# Altium schematic sheet RefPoint01-00.SchDoc
size A3
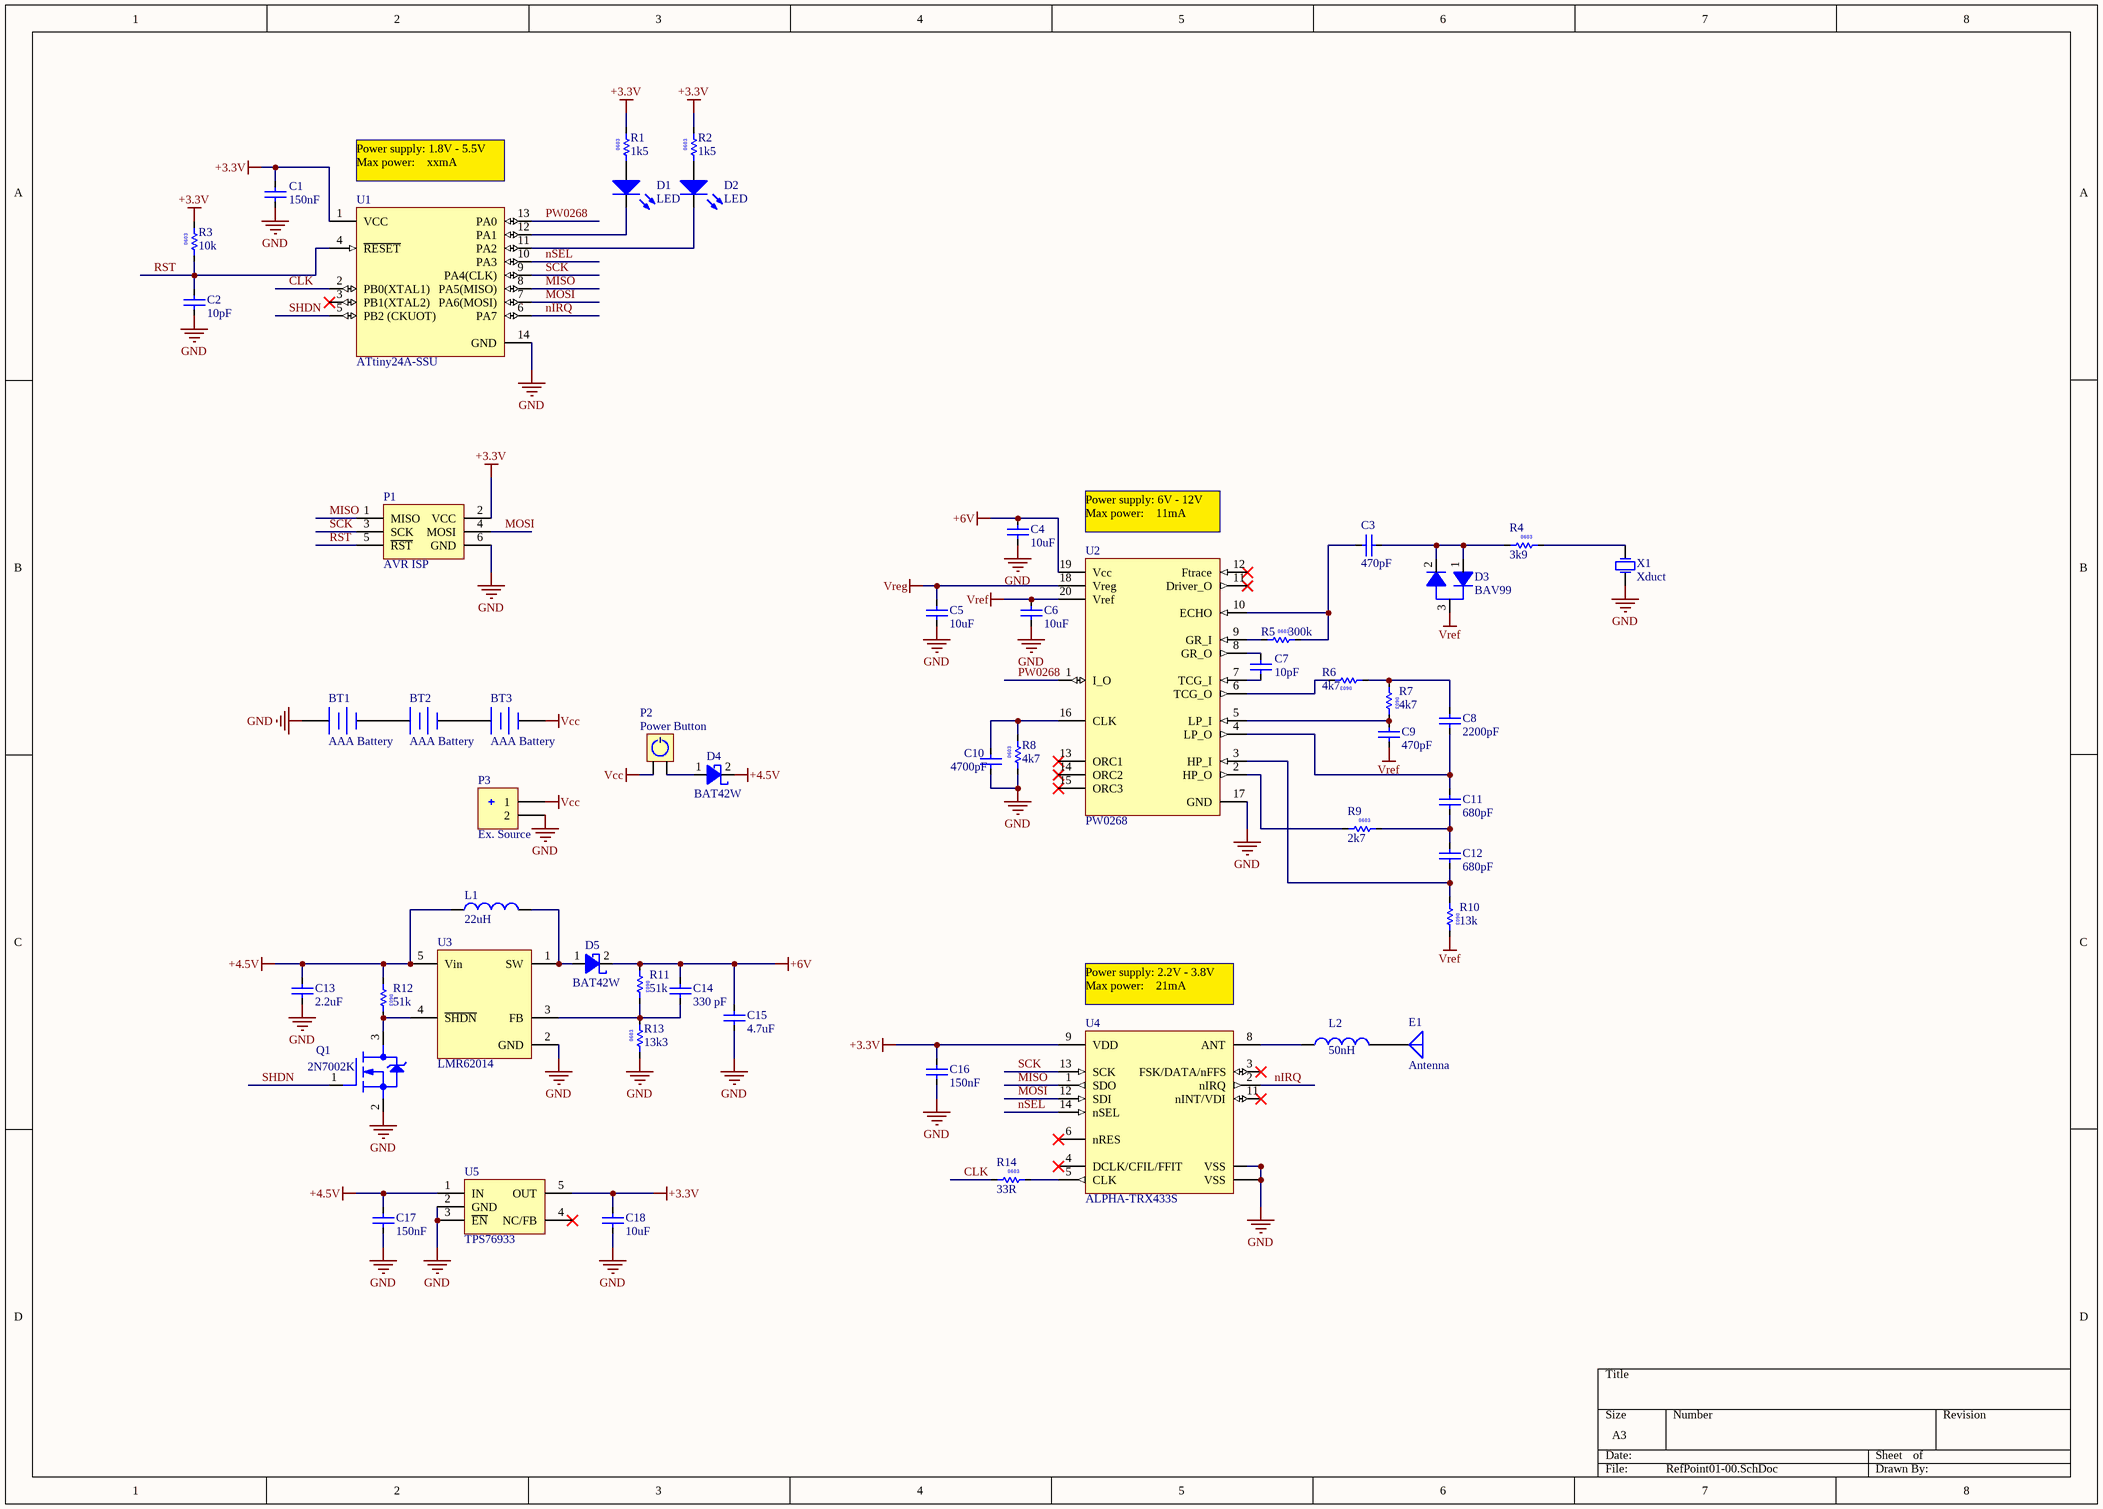
[diagram p0: RefPoint01-00.SchDoc]

## Parts
BT1  AAA Battery  [Keystone 55 AAA CLIP]
BT2  AAA Battery  [Keystone 55 AAA CLIP]
BT3  AAA Battery  [Keystone 55 AAA CLIP]
C1  150nF  [CAPC1608N]
C2  10pF  [CAPC1608N]
C3  470pF  [CAPC1608N]
C4  10uF  [CAPC3216N]
C5  10uF  [CAPC3216N]
C6  10uF  [CAPC3216N]
C7  10pF  [CAPC1608N]
C8  2200pF  [CAPC1608N]
C9  470pF  [CAPC1608N]
C10  4700pF  [CAPC1608N]
C11  680pF  [CAPC1608N]
C12  680pF  [CAPC1608N]
C13  2.2uF  [CAPC2012N]
C14  330 pF  [CAPC1608N]
C15  4.7uF  [CAPC3225N]
C16  150nF  [CAPC1608N]
C17  150nF  [CAPC1608N]
C18  10uF  [CAPC3216N]
D1  LED  [LED 3mm DIP]
D2  LED  [LED 3mm DIP]
D3  BAV99  [SOT95P240-3L]
D4  BAT42W  [SOD123]
D5  BAT42W  [SOD123]
E1  Antenna
L1  22uH  [INDM7070x32N]
L2  value 50nH  [INDC2012L]  (hidden comment: Inductor)
P1  AVR ISP  [HDR2X3]
P2  Power Button  [HDR1X2]
P3  Ex. Source  [HDR1X2]
Q1  2N7002K  [SOT23-3L]
R1  1k5  [RESC1608N]
R2  1k5  [RESC1608N]
R3  10k  [RESC1608N]
R4  3k9  [RESC1608N]
R5  300k  [RESC1608N]
R6  4k7  [RESC1608N]
R7  4k7  [RESC1608N]
R8  4k7  [RESC1608N]
R9  2k7  [RESC1608N]
R10  13k  [RESC1608N]
R11  51k  [RESC1608X50N]
R12  51k  [RESC1608X50N]
R13  13k3  [RESC1608X50N]
R14  33R  [RESC1608N]
U1  ATtiny24A-SSU  [SOIC14T_L]
U2  PW0268  [QSSOP20_0.635/4.0X8.7]
U3  LMR62014  [SOT23-5AM]
U4  ALPHA-TRX433S  [ALPHA-TRX]
U5  TPS76933  [SOT23-5AM]
X1  Xduct  [Xducts1]

## Nets
+3.3V: C1.2 C16.2 C18.2 P1.2(VCC) R1.2 R2.2 R3.2 U1.1(VCC) U4.9(VDD) U5.5(OUT)
+4.5V: C13.2 C17.2 D4.2(CATHODE) L1.2 R12.1 U3.5(Vin) U5.1(IN)
+6V: C4.2 C14.2 C15.2 D5.2(CATHODE) R11.1 U2.19(Vcc)
GND: BT1.1(+) C1.1 C2.1 C4.1 C5.1 C6.1 C10.1 C13.1 C15.1 C16.1 C17.1 C18.1 P1.6(GND) P3.2 Q1.2(S) R8.1 R13.1 U1.14(GND) U2.17(GND) U3.2(GND) U4.7(VSS) U4.10(VSS) U5.2(GND) U5.3(~{EN}) X1.2
Vcc: BT3.2(-) P2.1 P3.1
Vref: C6.2 C9.1 D3.3(K) R10.2 U2.20(Vref)
Vreg: C5.2 U2.18(Vreg)
CLK: R14.1 U1.2(PB0(XTAL1))
MISO: P1.1(MISO) U1.8(PA5(MISO)) U4.1(SDO)
MOSI: P1.4(MOSI) U1.7(PA6(MOSI)) U4.12(SDI)
nIRQ: U1.6(PA7) U4.2(nIRQ)
nSEL: U1.10(PA3) U4.14(nSEL)
PW0268: U1.13(PA0) U2.1(I_O)
RST: C2.2 P1.5(~{RST}) R3.1 U1.4(~{RESET})
SCK: P1.3(SCK) U1.9(PA4(CLK)) U4.13(SCK)
SHDN: Q1.1(G) U1.5(PB2_(CKUOT))
NetBT1_2: BT1.2(-) BT2.1(+)
NetBT2_2: BT2.2(-) BT3.1(+)
NetC3_1: C3.1 R5.2 U2.10(ECHO)
NetC3_2: C3.2 D3.1(A1) D3.2(A) R4.1
NetC7_1: C7.1 U2.8(GR_O)
NetC7_2: C7.2 U2.7(TCG_I)
NetC8_1: C8.1 C11.1 U2.4(LP_O)
NetC8_2: C8.2 R6.1 R7.1
NetC9_2: C9.2 R7.2 U2.5(LP_I)
NetC10_2: C10.2 R8.2 U2.16(CLK)
NetC11_2: C11.2 C12.1 R9.2
NetC12_2: C12.2 R10.1 U2.3(HP_I)
NetC14_1: C14.1 R11.2 R13.2 U3.3(FB)
NetD1_1: D1.1(A) R1.1
NetD1_2: D1.2(K) U1.12(PA1)
NetD2_1: D2.1(A) R2.1
NetD2_2: D2.2(K) U1.11(PA2)
NetD4_1: D4.1(ANODE) P2.2
NetD5_1: D5.1(ANODE) L1.1 U3.1(SW)
NetE1_1: E1.1(A) L2.2
NetL2_1: L2.1 U4.8(ANT)
NetQ1_3: Q1.3(D) R12.2 U3.4(~{SHDN})
NetR4_2: R4.2 X1.1
NetR5_1: R5.1 U2.9(GR_I)
NetR6_2: R6.2 U2.6(TCG_O)
NetR9_1: R9.1 U2.2(HP_O)
NetR14_2: R14.2 U4.5(CLK)

Not connected (* = marked no-connect by the designer): U1 3(PB1(XTAL2))*; U2 11(Driver_O)* 12(Ftrace)* 13(ORC1)* 14(ORC2)* 15(ORC3)*; U4 3(FSK/DATA/nFFS)* 4(DCLK/CFIL/FFIT)* 6(nRES)* 11(nINT/VDI)*; U5 4(NC/FB)*

## Notes on the sheet
- (near U1) Power supply: 1.8V - 5.5V
  Max power:    xxmA
- (near U2) Power supply: 6V - 12V
  Max power:    11mA
- (near U4) Power supply: 2.2V - 3.8V
  Max power:    21mA
- (in symbol R0000008) 0603
- (in symbol R0000455) 0603
- (in symbol R0000522) 0603
- (in symbol R2406036) 0603
- (in symbol R2406076) 0603
- (in symbol R2406082) 0603
- (in symbol R2406086) 0603
- (in symbol R2406088) 0603
- (in symbol R2406099) 0603
- (in symbol R2406131) 0603

## Library data of the parts
BT1-BT3 = Battery_AAA: Battery AAA; Manufacturer: KEYSTONE; Manufacturer Part Number: 55; Supplier Part Number 1: 1702644; Data Sheet: http://www.farnell.com/datasheets/1703982.pdf; Supplier 1: Farnell
C1 C16 C17 = C0000001: MLCC, 150nF 16V -20+80% Y5V; Manufacturer: YAGEO; Manufacturer Part Number: CTC0603ZRY5V7BB154; Voltage: 16; Project: PSP500; Part Number: C0000001; Part Type: MLCC; Tolerance: -20+80%; Material: Y5V; Package: 0603 (1608 metric); SMD: Yes; Supplier 1: Farnell; Supplier Part Number 1: 3352006; Supplier 2: Mouser; Supplier Part Number 2: 80-C0603C154K4R; ComponentLink1Description: MFG link; ComponentLink1URL: http://www.yageo.com/documents/recent/UPY-GPHC_Y5V_6.3V-to-50V_5.pdf; ComponentLink2URL: \\193.219.36.50\nescafe\Altium Database\KTU340DB\PDF\Capacitor\Multilayer Ceramic\UPY-GPHC_Y5V_6.3V-to-50V_5.pdf; Data: 2011.01.31
C2 C7 = C0000042: MLCC, 0603, NP0, 50V, 10PF; Manufacturer: MULTICOMP; Manufacturer Part Number: MCCA000192; Voltage: 100; Material: C0G / NP0; Project: Zhilinskas_I/II/III; Part Number: C0000042; Part Type: MLCC; Package: 0603 (1608 metric); SMD: Yes; Supplier 1: Farnell; Supplier Part Number 1: 1759053; Price: 0,02; MOQ: 100; Supplier 2: Mouser; Supplier Part Number 2: 77-VJ0603A100JXACBC; ComponentLink1Description: MFG link; ComponentLink1URL: http://www.farnell.com/datasheets/654515.pdf; Data: 2011.06.12
C3 C9 = C0000062: MLCC, 470pF 50V C0G 5% 0603; Manufacturer: MULTICOMP; Manufacturer Part Number: MCCA000217; Voltage: 50; Material: C0G / NP0; Part Number: C0000062; Part Type: MLCC; Tolerance: ±5%; Package: 0603 (1608 metric); SMD: Yes; Supplier 1: Farnell; Supplier Part Number 1: 1759080; ComponentLink1Description: MFG link; ComponentLink1URL: http://www.farnell.com/datasheets/654515.pdf; Qty: 100; Data: 2011.04.11
C4-C6 C18 = C0000011: MLCC, 10uF 25V -20%, +80% Y5V 1206; Manufacturer: MULTICOMP; Manufacturer Part Number: MC1206F106Z250CT; Voltage: 25; Project: PSP500; Part Number: C0000011; Part Type: MLCC; Tolerance: -20%, +80%; Material: Y5V; Package: 1206 (3216 metric); SMD: Yes; Supplier 1: Farnell; Supplier Part Number 1: 1759453; Price: 0,299; ComponentLink1Description: MFG link; ComponentLink1URL: http://www.farnell.com/datasheets/461910.pdf; Data: 2011.02.01
C8 = C0000126: MLCC, 2200pF 50V X7R 5% 0603; Manufacturer: MULTICOMP; Manufacturer Part Number: MC0603B222J500CT; Voltage: 50; Part Number: C0000126; Part Type: MLCC; Tolerance: ±5%; Material: X7R; Package: 0603 (1608 metric); SMD: Yes; Supplier 1: Farnell; Supplier Part Number 1: 2320806; ComponentLink1Description: MFG link; ComponentLink1URL: http://www.farnell.com/datasheets/1870456.pdf; Data: 2011.04.11
C10 = C0000127: MLCC, 4700pF 50V X7R 5% 0603; Manufacturer: MULTICOMP; Manufacturer Part Number: MC0603B472J500CT; Voltage: 50; Part Number: C0000127; Part Type: MLCC; Tolerance: ±5%; Material: X7R; Package: 0603 (1608 metric); SMD: Yes; Supplier 1: Farnell; Supplier Part Number 1: 2320809; ComponentLink1Description: MFG link; ComponentLink1URL: http://www.farnell.com/datasheets/1870456.pdf; Data: 2011.04.11
C11 C12 = C0000125: MLCC, 680pF 50V C0G / NP0 5% 0603; Manufacturer: MULTICOMP; Manufacturer Part Number: MC0603N681J500CT; Voltage: 50; Part Number: C0000125; Part Type: MLCC; Tolerance: ±5%; Material: C0G / NP0; Package: 0603 (1608 metric); SMD: Yes; Supplier 1: Farnell; Supplier Part Number 1: 1759084; ComponentLink1Description: MFG link; ComponentLink1URL: http://www.farnell.com/datasheets/1901289.pdf; Data: 2011.04.11
C13 = C0000129: MLCC, 2.2uF 16V X7R 0805; Manufacturer: MURATA; Manufacturer Part Number: GRM21BR71C225KA12L; Tolerance: ±10%; Part Number: C0000129; Part Type: MLCC; Voltage: 16V; Material: X7R; Package: 0805 (2012 metric); SMD: Yes; Supplier 1: Farnell; Supplier Part Number 1: 1828829; ComponentLink1Description: MFG link; ComponentLink1URL: http://www.farnell.com/datasheets/608985.pdf; Data: 2011.03.07
C14 = C0000018: MLCC, 50V, 330pF, 10%, X7R, 0603; Manufacturer: KEMET; Manufacturer Part Number: C0603S331K5RACTU; Voltage: 50; Note: 0,157 euro; Part Number: C0000018; Part Type: MLCC; Tolerance: 10 %; Material: X7R; Package: 0603 (1608 metric); SMD: Yes; Supplier 1: Mouser; Supplier Part Number 1: 80-C0603S331K5R; Supplier 2: Mouser; Supplier Part Number 2: 80-C0603S331K5R; ComponentLink1Description: MFG link; ComponentLink1URL: http://www.kemet.com/kemet/web/homepage/kechome.nsf/weben/9BCEE159EBBBB79F852572B3004D0849/$file/F3280_X7R_FloatElectrode.pdf; Data: 2011.02.25
C15 = C0000130: MLCC, 4.7uF 16V X7R 1210; Manufacturer: MURATA; Manufacturer Part Number: GRM32ER71H475KA88L; Voltage: 50V; Tolerance: ±10%; Part Number: C0000130; Part Type: MLCC; Material: X7R; Package: 1210 (3225 metric); SMD: Yes; Supplier 1: Farnell; Supplier Part Number 1: 1828841; ComponentLink1Description: MFG link; ComponentLink1URL: http://www.farnell.com/datasheets/1747494.pdf; Data: 2011.03.07
D1 D2 = LED0: Typical INFRARED GaAs LED; Published: 8-Jun-2000; LatestRevisionDate: 08-Jul-2005; LatestRevisionNote: Mech Layer 1 removed.; PackageReference: LED-0; Publisher: Altium Limited
D3 = D0000001: DIODE SW DUAL 75V 350mW SOT23; Manufacturer: ON SEMICONDUCTOR; Manufacturer Part Number: BAV99-7-F; Vforvard: 1.25V; Current: 2A; Project: AUT-RX03-00; Note: 0,289 €; Part Number: D0000001; Part Type: Diode\Small signal; Reverse Voltage: 75V; Rating: 350mW; SMD: Yes; ComponentLink1Description: MFG link; ComponentLink1URL: http://www.onsemi.com/pub_link/Collateral/BAV99LT1-D.PDF; ComponentLink2Description: DataSheet; Qty: 6000; Data: 2011.02.27; Supplier 1: Farnell; Supplier Part Number 1: 1843683; Supplier 2: Mouser; Supplier Part Number 2: 621-BAV99-F
D4 D5 = D0000003: Diode Schottkey, 30V, Vf=1V, If=1A, rrt=5ns, SOD123, -55°C to +125°C; Manufacturer: VISHAY SEMICONDUCTOR; Manufacturer Part Number: BAT42W-V-GS18; Vforvard: 1V; Current: 0.2A; Capacitance: 7pF; Rating: 200mW; Project: PSP500; Part Number: D0000003; Part Type: Diode\Schottky; Reverse Voltage: 30V; SMD: Yes; Price: 0,84; ComponentLink1Description: MFG link; ComponentLink1URL: http://www.vishay.com/docs/85661/bat42w-v.pdf; ComponentLink2Description: BAT42W; ComponentLink2URL: \\193.219.36.50\nescafe\Altium Database\KTU340DB\PDF\Diodes\Schottkey\bat42w-v.pdf; Data: 2011.01.28; Supplier 1: Farnell; Supplier Part Number 1: 1612326; Supplier 2: Mouser; Supplier Part Number 2: 78-BAT42W-VGS18
E1 = Antenna: Generic Antenna; Published: 24-Mar-1999; LatestRevisionDate: 17-Jul-2002; LatestRevisionNote: Re-released for DXP Platform.; PackageReference: PIN1; Publisher: Altium Limited
L1 = L Inductor 810-SLF732220MR962PF: Inductor; Manufacturer: TDK; Manufacturer Part Number: 810-SLF732220MR962PF; Data Sheet: http://www.mouser.com/catalog/specsheets/tdk_e531_slf.pdf; Supplier Part Number 1: 810-SLF732220MR962PF; Supplier 1: Mouser
L2 = Inductor: Code_IEC: 1005; Published: 8-Jun-2000; LatestRevisionDate: 29-May-2009; LatestRevisionNote: IPC-7351 Footprint Added.; PackageReference: 0402-A; Publisher: Altium Limited; PackageDescription: Chip Inductor; Code_JEITA: 0402
P1 = AVR ISP: Header, 6-Pin; LatestRevisionDate: 17-Jul-2002; LatestRevisionNote: Re-released for DXP Platform.; Publisher: Altium Limited
P2 = Power Button: Header, 2-Pin, Right Angle; LatestRevisionDate: 17-Jul-2002; LatestRevisionNote: Re-released for DXP Platform.; Publisher: Altium Limited
P3 = Maitinimas: Header, 2-Pin; LatestRevisionDate: 17-Jul-2002; LatestRevisionNote: Re-released for DXP Platform.; Publisher: Altium Limited
Q1 = Q0000008: MOSFET N-CH 60V 340MA SOT23; Manufacturer: NXP; Manufacturer Part Number: 2N7002K,215; RdsON: 3.9Ω; Id: 500mA; Rating: 830mW; Part Number: Q0000008; Part Type: MOSFET\N-CH\LogicLevel; Vds: 60V; SMD: Yes; Supplier 1: Farnell; Supplier Part Number 1: 1758065; Price: 0,23; MOQ: 1; Supplier 2: Tape; Supplier Part Number 2: Yes; ComponentLink1Description: MFG link; ComponentLink1URL: http://www.nxp.com/acrobat_download/datasheets/2N7002K-01.pdf; ComponentLink2Description: Datasheet MFG; ComponentLink2URL: 1; Qty: 10
R1 R2 = R2406076: 1K5 5% 0603 1/10W; Manufacturer: YAGEO; Manufacturer Part Number: RC0603FR-071K5L; R2408042: R2406076; Part type: Carbon Film; Tolerance: ±5%; Power: 1/10W; Package: 0603 (1608 metric); SMD: Yes; Supplier 1: Farnell; Supplier Part Number 1: 9238506; Supplier 2: Mouser; Supplier Part Number 2: 667-ERJ-3GEYJ152V; Data: 2011.01.31
R3 = R0000008: Res, 10K 0.063W 75V 1%  0603; Manufacturer: MULTICOMP; Manufacturer Part Number: MCMR06X1002FTL; Project: AUT-RX03-00; Note: 0,033 €; R2408042: R0000008; Part type: Thick Film; Tolerance: ±1%; Power: 0.063W; Package: 0603 (1608 metric); SMD: Yes; Supplier 1: Farnell; Supplier Part Number 1: 2073349; Supplier 2: Mouser; Supplier Part Number 2: 594-MCT06030C1002FP5; ComponentLink1Description: Datasheet MFG; ComponentLink1URL: http://www.vishay.com/doc?28705; Data: 2011.02.28
R4 = R2406086: 3K9 5% 0603 1/10W; R2408042: R2406086; Part type: Carbon Film; Tolerance: ±5%; Power: 1/10W; Package: 0603 (1608 metric); SMD: Yes; Data: 2011.01.31
R5 = R2406131: 300K 5% 0603 1/10W; R2408042: R2406131; Part type: Carbon Film; Tolerance: ±5%; Power: 1/10W; Package: 0603 (1608 metric); SMD: Yes; Data: 2011.01.31
R6-R8 = R2406088: Res, 4K7 5% 0603 1/10W; R2408042: R2406088; Part type: Carbon Film; Tolerance: ±5%; Power: 1/10W; Package: 0603 (1608 metric); SMD: Yes; Supplier 1: Farnell; Supplier Part Number 1: 1652884; Data: 2011.01.31
R9 = R2406082: 2K7 5% 0603 1/10W; R2408042: R2406082; Part type: Carbon Film; Tolerance: ±5%; Power: 1/10W; Package: 0603 (1608 metric); SMD: Yes; Supplier 1: Farnell; Supplier Part Number 1: 2059612; Data: 2011.01.31
R10 = R2406099: 13K 5% 0603 1/10W; Manufacturer: PANASONIC; Manufacturer Part Number: ERJ3GEYJ133V; R2408042: R2406099; Part type: Carbon Film; Tolerance: ±5%; Power: 1/10W; Package: 0603 (1608 metric); SMD: Yes; Supplier 1: Farnell; Supplier Part Number 1: 2059632; Supplier 2: Mouser; Supplier Part Number 2: 667-ERJ-3GEYJ133V; Data: 2011.01.31
R11 R12 = R0000522: Res, 51K, 0603 (1608 metric), ±1%, 100mW, 75V; Manufacturer: PANASONIC; Manufacturer Part Number: ERJ3EKF5102V; R2408042: R0000522; Part type: Thick Film; Tolerance: ±1%; Power: 100mW; Package: 0603 (1608 metric); SMD: Yes; Supplier 1: Farnell; ComponentLink1Description: MFG link; ComponentLink1URL: http://www.farnell.com/datasheets/1678782.pdf; Data: 2015.09.15
R13 = R0000455: Res, 13K3, 0603 (1608 metric), ±1%, 100mW, 75V; Manufacturer: PANASONIC; Manufacturer Part Number: ERJ3EKF1332V; R2408042: R0000455; Part type: Thick Film; Tolerance: ±1%; Power: 100mW; Package: 0603 (1608 metric); SMD: Yes; Supplier 1: Farnell; ComponentLink1Description: MFG link; ComponentLink1URL: http://www.farnell.com/datasheets/1678782.pdf; Data: 2015.09.15
R14 = R2406036: 33R 5% 0603 1/10W; R2408042: R2406036; Part type: Carbon Film; Tolerance: ±5%; Power: 1/10W; Package: 0603 (1608 metric); SMD: Yes; Supplier 1: Farnell; Supplier Part Number 1: 9332006; Data: 2011.01.31
U1 = ATtiny24A-SSU: Manufacturer: Atmel; Manufacturer Part Number: ATtiny24A-SSU; Data Sheet: http://www.farnell.com/datasheets/332546.pdf; Supplier Part Number 1: 1699395; Supplier 1: Farnell
U2 = PW0268: Manufacturer: PROWAVE; Manufacturer Part Number: PW0268; Data Sheet: http://www.farnell.com/datasheets/1714673.pdf; Supplier Part Number 1: 1007371; Supplier 1: Farnell
U3 = LMR62014: 2064695; Manufacturer Part Number: LMR62014XMFE; Manufacturer: TEXAS INSTRUMENTS; Data Sheet: http://www.ti.com/lit/ds/symlink/lmr62014.pdf; Supplier Part Number 1: 2064695; Supplier 1: Farnell
U4 = ALPHA-TRX433S: RF SOLUTIONS  ALPHA-TRX433S  RF MODULE, TRANSCEIVER, FSK, 433MHZ; Manufacturer Part Number: ALPHA-TRX433S; Manufacturer: RF SOLUTIONS; Data Sheet: http://www.farnell.com/datasheets/1718776.pdf; Supplier 1: Farnell; Supplier Part Number 1: 1718689
U5 = TPS769xx: ULTRALOW-POWER 100-mA LOW-DROPOUT LINEAR REGULATORS; Manufacturer Part Number: TPS76933DBVT; Manufacturer: TEXAS INSTRUMENTS; Supplier Part Number 1: 8461538; Supplier 1: Farnell; Data Sheet: http://www.farnell.com/datasheets/1882401.pdf
X1 = Xduct1: Transducer